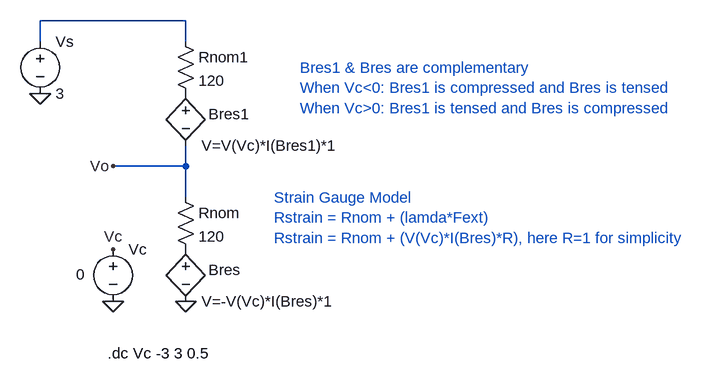
[diagram p0: schematic Lab 1 Experiment 1 - 2 Strain Gauges.asc]
Lab 1 Experiment 1 - 2 Strain Gauges.asc, the LTspice schematic file:
Version 4
SHEET 1 880 680
WIRE -32 -160 -256 -160
WIRE -256 -128 -256 -160
WIRE -32 -128 -32 -160
WIRE -32 64 -32 32
WIRE -32 64 -144 64
WIRE -32 112 -32 64
FLAG -144 272 0
FLAG -144 192 Vc
FLAG -32 272 0
FLAG -256 -48 0
FLAG -144 64 Vo
SYMBOL bv -32 176 R0
WINDOW 0 35 48 Left 2
SYMATTR InstName Bres
SYMATTR Value V=-V(Vc)*I(Bres)*1
SYMBOL voltage -144 176 R0
WINDOW 3 -57 55 Left 2
WINDOW 123 0 0 Left 0
WINDOW 39 0 0 Left 0
SYMATTR InstName Vc
SYMATTR Value 0
SYMBOL res -48 96 R0
SYMATTR InstName Rnom
SYMATTR Value 120
SYMBOL voltage -256 -144 R0
WINDOW 123 0 0 Left 0
WINDOW 39 0 0 Left 0
SYMATTR InstName Vs
SYMATTR Value 3
SYMBOL bv -32 -64 R0
WINDOW 0 35 48 Left 2
SYMATTR InstName Bres1
SYMATTR Value V=V(Vc)*I(Bres1)*1
SYMBOL res -48 -144 R0
SYMATTR InstName Rnom1
SYMATTR Value 120
TEXT 104 112 Left 2 ;Strain Gauge Model\nRstrain = Rnom + (lamda*Fext)\nRstrain = Rnom + (V(Vc)*I(Bres)*R), here R=1 for simplicity
TEXT -152 352 Left 2 !.dc Vc -3 3 0.5
TEXT 144 -88 Left 2 ;Bres1 & Bres are complementary\nWhen Vc<0: Bres1 is compressed and Bres is tensed\nWhen Vc>0: Bres1 is tensed and Bres is compressed

The netlist it stands for:
* Lab 1 Experiment 1 - 2 Strain Gauges.asc
Bres P001 0 V=-V(Vc)*I(Bres)*1
Vc Vc 0 0
Rnom Vo P001 120
Vs N001 0 3
Bres1 P002 Vo V=V(Vc)*I(Bres1)*1
Rnom1 N001 P002 120
* Strain Gauge Model
* Rstrain = Rnom + (lamda*Fext)
* Rstrain = Rnom + (V(Vc)*I(Bres)*R), here R=1 for simplicity
.dc Vc -3 3 0.5
* Bres1 & Bres are complementary
* When Vc<0: Bres1 is compressed and Bres is tensed
* When Vc>0: Bres1 is tensed and Bres is compressed
.backanno
.end